# EAGLE design lightstrip-driver (EAGLE 7.2.0)
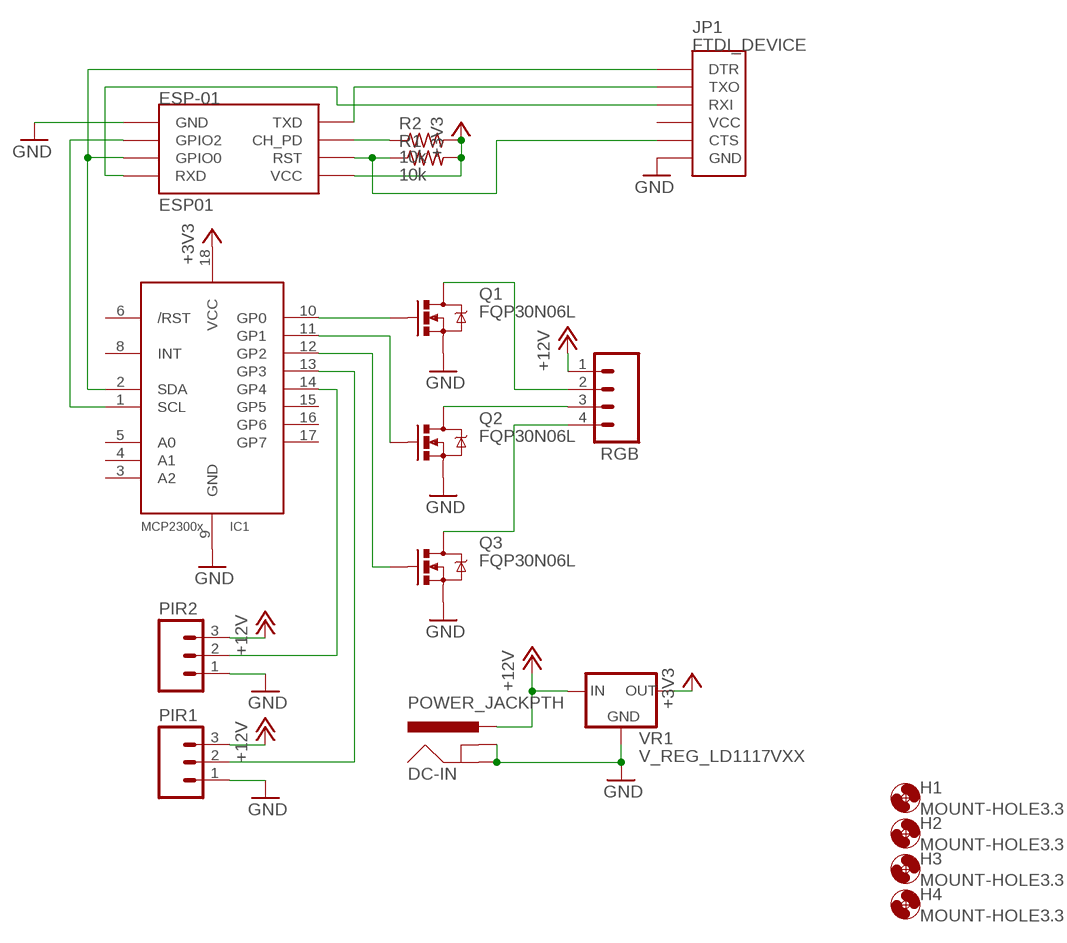
[diagram p0: schematic, sheet 1]

## Parts
DC-IN  POWER_JACKPTH  [POWER_JACK_PTH]
ESP-01  ESP01  [ESP01]
H1  MOUNT-HOLE3.3  [3,3]
H2  MOUNT-HOLE3.3  [3,3]
H3  MOUNT-HOLE3.3  [3,3]
H4  MOUNT-HOLE3.3  [3,3]
IC1  MCP2300X/P  [DIL18]
JP1  FTDI_DEVICE  [FTDI_DEVICE_SIDE]
PIR1  M03PTH  [1X03]
PIR2  M03PTH  [1X03]
Q1  FQP30N06L  MOSFET-NCHANNELFQP30N06L  [TO220V]
Q2  FQP30N06L  MOSFET-NCHANNELFQP30N06L  [TO220V]
Q3  FQP30N06L  MOSFET-NCHANNELFQP30N06L  [TO220V]
R1  10k  R-US_0207/7  [0207/7]
R2  10k  R-US_0207/7  [0207/7]
RGB  M04PTH  [1X04]
VR1  V_REG_LD1117VXX  [78XXL]

## Nets
+3V3: ESP-01.VCC IC1.18(VCC) R1.2 R2.2 VR1.GND(OUT)
+12V [power]: DC-IN.PWR PIR1.3 PIR2.3 RGB.1 VR1.OUT(IN)
GND: DC-IN.GND DC-IN.GNDBREAK ESP-01.GND IC1.9(GND) JP1.P$6(GND) PIR1.1 PIR2.1 Q1.3(S) Q2.3(S) Q3.3(S) VR1.IN(GND)
N$1: IC1.13(GP3) PIR1.2
N$2: ESP-01.GPIO2 IC1.1(SCL)
N$3: ESP-01.CH_PD R2.1
N$4: IC1.10(GP0) Q1.1(G)
N$5: IC1.11(GP1) Q2.1(G)
N$6: IC1.12(GP2) Q3.1(G)
N$7: ESP-01.RX(RXD) JP1.P$3(RXI)
N$8 [power]: Q1.2(D) RGB.2
N$9: ESP-01.TX(TXD) JP1.P$2(TXO)
N$11 [power]: Q2.2(D) RGB.3
N$12 [power]: Q3.2(D) RGB.4
N$13: IC1.14(GP4) PIR2.2
N$14: ESP-01.GPIO0 IC1.2(SDA) JP1.P$1(DTR)
N$15: ESP-01.RST JP1.P$5(CTS) R1.1
Unconnected: IC1.3(A2) IC1.4(A1) IC1.5(A0) IC1.6(/RST) IC1.8(INT) IC1.15(GP5) IC1.16(GP6) IC1.17(GP7) JP1.P$4(VCC)

## Library data of the parts
DC-IN = SparkFun-Connectors:POWER_JACK: Power Jack This is the standard 5.5mm barrel jack for power. The PTH is the most common, proven, reliable, footprint. The Slot footprint only works if the mill layer is transmitted to the PCB fab house so be warned. Mating wall wart : TOL-00298 (and others); PROD_ID: CONN-08197
ESP-01 = esp8266modules:ESP01: ESP8266 Wifi module 01
H1-H4 = holes:MOUNT-HOLE: MOUNTING HOLE with drill center marker
IC1 = adafruit:MCP2300X: MCP23008 Inexpensive i2c i/o expander - 8 general purpose i/o pins with optional pullups
JP1 = SparkFun-Connectors:FTDI_DEVICE: Connector which mates to FTDI basic or FTDI cable.
PIR1 PIR2 = SparkFun-Connectors:M03: Header 3 Standard 3-pin 0.1" header. Use with straight break away headers (SKU : PRT-00116), right angle break away headers (PRT-00553), swiss pins (PRT-00743), machine pins (PRT-00117), and female headers (PRT-00115). Molex polarized connector foot print use with SKU : PRT-08232 with associated crimp pins and housings.
Q1-Q3 = SparkFun-DiscreteSemi:MOSFET-NCHANNEL: Common NMOSFET Parts MFG P/N Store ID Prod ID FDD8780 TRANS-09984 SI7820DN TRANS-11055 FDS6630A IC-08089 2N7002PW TRANS-11151 FQP30N06L COM-10213 TRANS-10060 BSS123LT1G TRANS-08345 BSS138 TRANS-00830 BS170 2N7000; PROD_ID: TRANS-10060
R1 R2 = resistor:R-US_: RESISTOR, American symbol
RGB = SparkFun-Connectors:M04: Header 4 Standard 4-pin 0.1" header. Use with straight break away headers (SKU : PRT-00116), right angle break away headers (PRT-00553), swiss pins (PRT-00743), machine pins (PRT-00117), and female headers (PRT-00115). Molex polarized connector foot print use with SKU : PRT-08231 with associated crimp pins and housings. 1MM SMD Version SKU: PRT-10208
VR1 = SparkFun-PowerIC:V_REG_LD1117VXX: LD1117VXX voltage regulator. We carry the 3.3V version (COM-00526) in TO-220 package.

## Net classes
1 power: width 0.762 mm

## Board
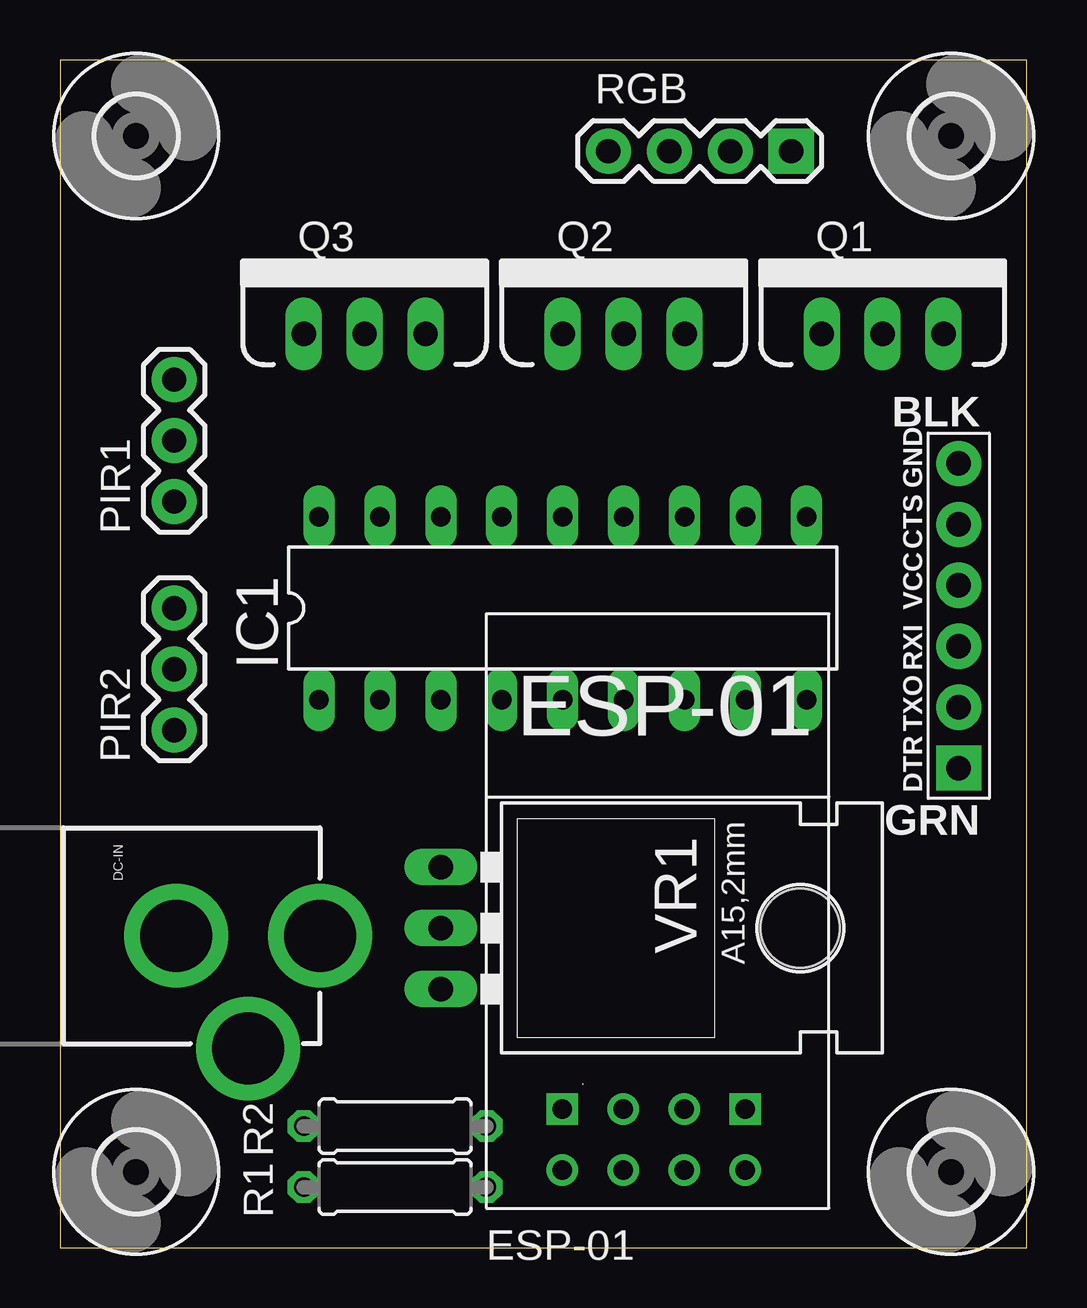
[diagram p1: board, top side]
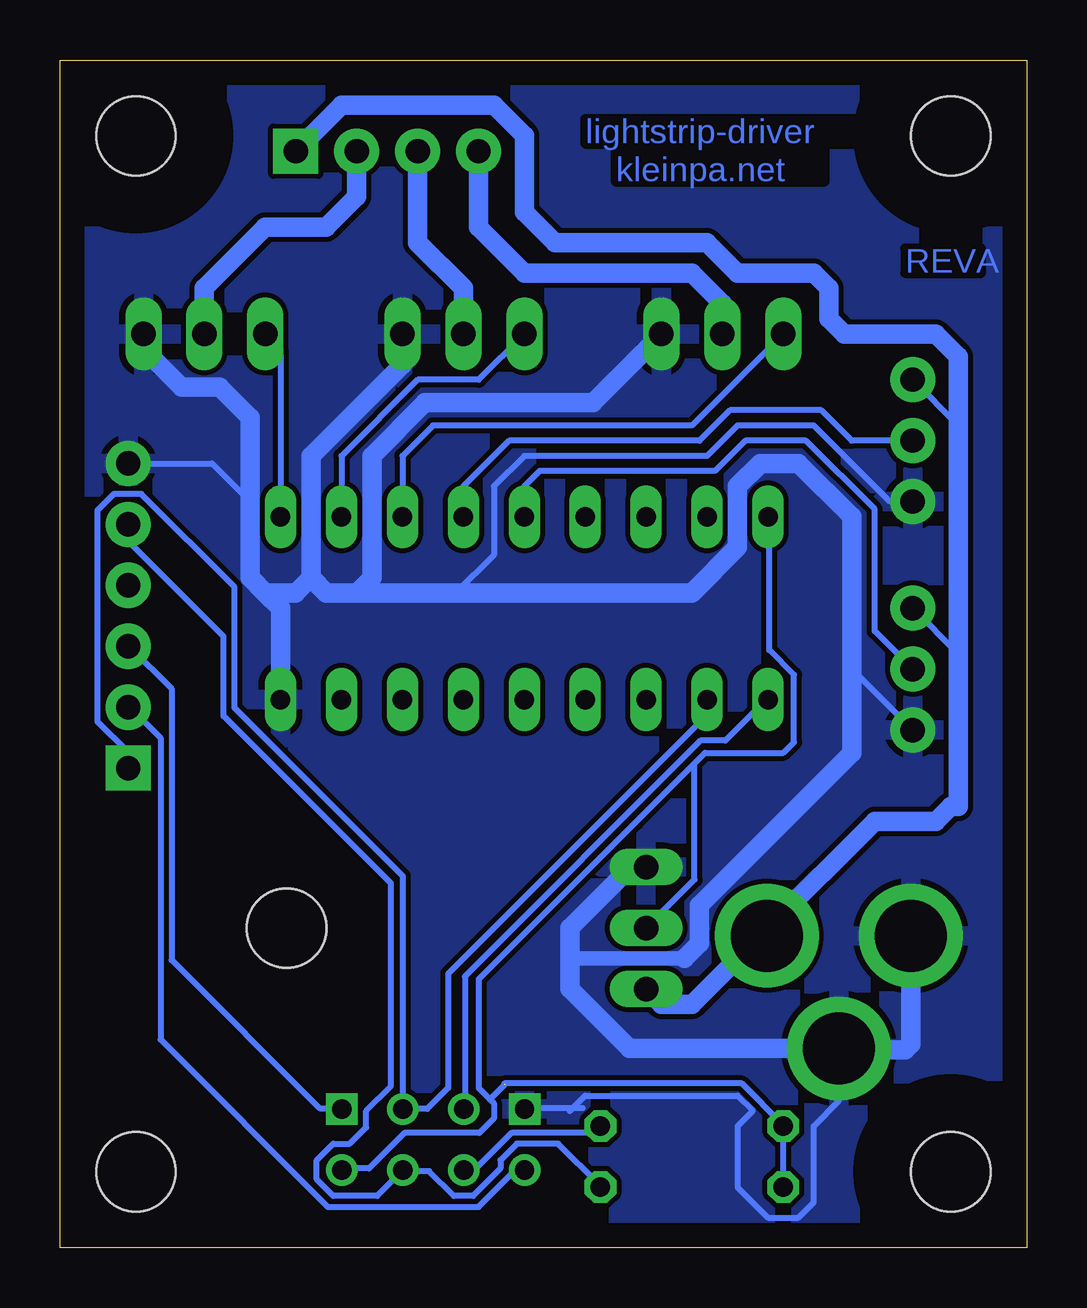
[diagram p2: board, bottom side, seen from below]

Size 40.31 x 49.52 mm. Coordinates in mm from the lower left corner, seen from the top.
Outline: 0,0 40.31,0 40.31,49.52 0,49.52 0,0
Copper layers (1*16): Top 0.035mm / dielectric 1.5mm / Bottom 0.035mm
Design rules "default": minimum track width 10mil, minimum drill 24mil, track to track 8mil, track to pad 8mil, pad to pad 8mil, via to via 8mil, smd to smd 8mil, copper to edge 40mil, drill to drill 8mil, minimum pad ring 10mil, minimum via ring 8mil, stop-mask expansion 4mil, vias tented up to drill 0mil, thermal gap 10mil

### Footprints (pad centres in the part's own frame; a part is rotated, then mirrored left to right if it is on the bottom)
POWER_JACK_PTH = drill 2.997 pad 4.318: GND 0,7.7; GNDBREAK 4.7,10.7; PWR 0,13.7
ESP01 = drill 0.8: CH_PD -1.285,-8.178; GPIO0 1.255,-5.638; GPIO2 -1.285,-5.638; RST 1.255,-8.178; TX -3.825,-8.178; VCC 3.795,-8.178 | drill 0.8 square: GND -3.825,-5.638; RX 3.795,-5.638
3,3 = hole 3.3: 0,0
DIL18 = drill 0.813 long: 1 -10.16,-3.81; 2 -7.62,-3.81; 3 -5.08,-3.81; 4 -2.54,-3.81; 5 0,-3.81; 6 2.54,-3.81; 7 5.08,-3.81; 8 7.62,-3.81; 9 10.16,-3.81; 10 10.16,3.81; 11 7.62,3.81; 12 5.08,3.81; 13 2.54,3.81; 14 0,3.81; 15 -2.54,3.81; 16 -5.08,3.81; 17 -7.62,3.81; 18 -10.16,3.81
FTDI_DEVICE_SIDE = drill 1.016 pad 1.88 square: P$1 -6.35,0 | drill 1.016 pad 1.88: P$2 -3.81,0; P$3 -1.27,0; P$4 1.27,0; P$5 3.81,0; P$6 6.35,0
1X03 = drill 1.016 pad 1.88: 1 0,0; 2 2.54,0; 3 5.08,0
TO220V = drill 1.016 long: 1 -2.54,0; 2 0,0; 3 2.54,0
0207/7 = drill 0.813 octagon: 1 -3.81,0; 2 3.81,0
1X04 = drill 1.016 pad 1.88 square: 1 0,0 | drill 1.016 pad 1.88: 2 2.54,0; 3 5.08,0; 4 7.62,0
78XXL = drill 1.016 long: GND 0,-3.81; IN -2.54,-3.81; OUT 2.54,-3.81 | hole 3.302: 0,11.176

### Placement (x,y rotation side)
DC-IN  -2.86,13.02 270 top
ESP-01  24.77,11.43 0 top
H1  37.15,46.35 0 top
H2  3.17,46.35 0 top
H3  3.17,3.17 0 top
H4  37.15,3.17 0 top
IC1  20.95,26.67 0 top
JP1  37.47,26.35 90 top
PIR1  4.76,31.11 90 top
PIR2  4.76,21.59 90 top
Q1  34.29,38.1 0 top
Q2  23.5,38.1 0 top
Q3  12.7,38.1 0 top
R1  13.97,2.54 180 top
R2  13.97,5.08 180 top
RGB  30.48,45.72 180 top
VR1  19.68,13.34 270 top

### Tracks (layer width: path | path; a pad name or v marks a point on that pad's centre or on a via)
+3V3  (1 unrouted)
  Bottom 0.254: 21.78,6.86 11.89,6.86 10.17,5.14 R2.2 10.17,5.03 10.17,2.63 R1.2 | ESP-01.VCC 28.46,3.31 27.43,3.31 25.95,4.8 22.82,4.8 22.23,5.4 22.23,6.03 22.38,6.19 | IC1.18 10.74,30.4 10.74,24.92 9.72,23.89 9.72,21.08 10.16,20.64 13.42,20.64 13.86,20.21 | 13.86,20.21 22.86,11.2 22.86,6.67 22.38,6.19 | VR1.GND 13.86,15.35 13.86,20.21 | 21.78,6.79 22.38,6.19
+12V
  Bottom 0.254: PIR1.3 2.86,34.29 | PIR2.3 2.86,24.77
  Bottom 0.813: RGB.1 28.57,47.62 22.23,47.62 20.95,46.35 20.95,43.18 19.68,41.91 13.34,41.91 12.06,40.64 8.89,40.64 8.26,40.01 8.26,38.73 7.62,38.1 3.81,38.1 2.86,37.15 2.86,34.29 2.86,24.77 2.86,18.41 3.17,18.41 3.81,17.78 6.35,17.78 10.79,13.34 DC-IN.PWR 11.43,12.7 13.97,10.16 15.24,10.16 VR1.OUT
GND
  Bottom 0.254: PIR1.1 5.71,31.11 8.89,34.29 12.06,34.29 13.34,33.02 20.95,33.02 22.23,31.75 22.23,28.89 23.81,27.3 | JP1.P$6 33.97,32.7 32.38,31.11 | 18.52,5.83 19.05,5.83 | 19.05,5.83 20.92,5.83 ESP-01.GND | PIR2.1 7.3,24.13 | 19.05,5.83 19.05,5.71 18.41,6.35 12.06,6.35 11.43,5.71 12.06,5.08 12.06,2.54 10.79,1.27 9.53,1.27 8.89,1.91 8.89,5.08 7.84,6.13 DC-IN.GNDBREAK
  Bottom 0.61: 14.29,12.06 19.05,12.06
  Bottom 0.813: Q3.3 18.1,35.24 25.08,35.24 27.3,33.02 27.3,27.94 27.94,27.3 | 29.84,27.94 29.84,33.02 26.04,36.83 Q2.3 | Q1.3 36.83,37.47 35.24,35.88 33.66,35.88 32.38,34.61 32.38,31.11 32.38,27.94 31.75,27.3 | 29.84,27.94 29.21,27.3 27.94,27.3 | 31.75,27.3 30.48,27.3 29.84,27.94 | VR1.IN 16.51,15.88 19.05,13.34 19.05,12.06 19.05,10.79 16.57,8.32 DC-IN.GNDBREAK 7.78,8.26 5.08,8.26 4.84,8.49 DC-IN.GND | 31.75,27.3 31.11,26.67 IC1.9 | 27.94,27.3 23.81,27.3 13.97,27.3 12.06,29.21 12.06,31.75 11.11,32.7 9.53,32.7 7.3,30.48 7.3,24.13 7.3,20.64 13.65,14.29 13.65,12.7 14.29,12.06
  pour Bottom: 0,49.53 40.64,49.53 40.64,0 0,0
N$1
  Bottom 0.254: PIR1.2 7.3,33.66 8.57,34.92 12.38,34.92 13.65,33.66 21.59,33.66 23.5,31.75 IC1.13
N$2
  Bottom 0.254: ESP-01.GPIO2 23.43,5.83 23.43,11.32 13.6,21.14 12.57,21.14 10.86,22.86 IC1.1
N$3
  Bottom 0.254: R2.1 18.06,4.8 21.49,4.8 22.97,3.31 23.43,3.31 ESP-01.CH_PD
N$4
  Bottom 0.254: Q1.1 31.11,37.47 IC1.10
N$5
  Bottom 0.254: Q2.1 22.86,36.2 25.4,36.2 28.57,33.02 IC1.11
N$6
  Bottom 0.254: Q3.1 13.97,34.29 24.77,34.29 26.04,33.02 IC1.12
N$7
  Bottom 0.254: ESP-01.RX 28.57,5.83 29.49,5.83 35.66,12 35.66,23.32 37.38,25.03 JP1.P$3
N$8
  Bottom 0.813: Q1.2 34.29,40.01 31.75,42.55 29.21,42.55 27.94,43.81 RGB.2
N$9
  Bottom 0.254: ESP-01.TX 21.03,3.2 21.37,3.2 22.86,1.71 29.15,1.71 36.12,8.69 36.12,21.26 37.38,22.52 JP1.P$2
N$11
  Bottom 0.813: Q2.2 23.5,40.01 25.4,41.91 RGB.3
N$12
  Bottom 0.813: Q3.2 12.7,39.37 13.97,40.64 20.95,40.64 22.86,42.55 RGB.4
N$13
  Bottom 0.254: PIR2.2 6.35,25.72 6.35,30.8 9.21,33.66 11.75,33.66 13.02,32.38 20.32,32.38 20.95,31.75 IC1.14
N$14
  Bottom 0.254: JP1.P$1 37.49,20 37.49,20.69 38.75,21.95 38.75,30.75 38.06,31.43 36.92,31.43 33.03,27.55 33.03,22.52 26.02,15.5 ESP-01.GPIO0 25,5.79 24.13,6.67 24.13,11.43 13.34,22.23 IC1.2
N$15
  Bottom 0.254: R1.1 17.83,2.63 19.55,4.34 21.26,4.34 21.95,3.66 21.95,3.31 23.09,2.17 23.89,2.17 24.92,3.2 25.95,3.2 ESP-01.RST 26.06,3.2 27.09,2.17 28.92,2.17 29.6,2.86 29.6,3.66 28.92,4.34 28.23,4.34 27.55,5.03 27.55,5.71 26.52,6.74 26.52,15.2 33.49,22.17 33.49,25.49 37.38,29.38 37.38,30.06 JP1.P$5

### Text on the board
Bottom: lightstrip-driver | kleinpa.net | REVA